# Altium schematic sheet Power.SchDoc
size A4; DocumentNumber: 2; SheetNumber: 2; SheetTotal: 4
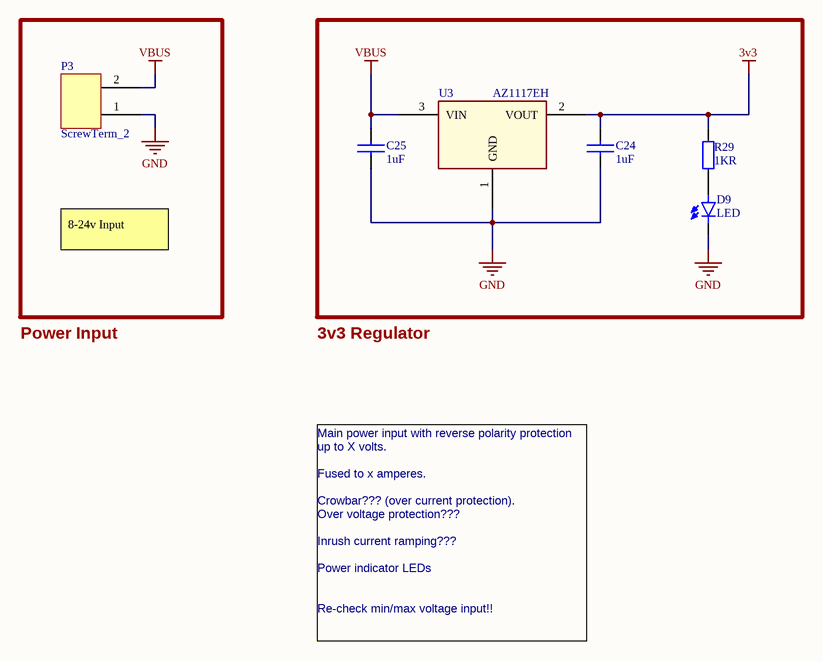
[diagram p0: Power.SchDoc]

## Parts
C24  1uF  [RESC0603(1608)_N]
C25  1uF  [RESC0603(1608)_N]
D9  LED  [0603]
P3  ScrewTerm_2  [ScrewTerm_2]
R29  1KR  [RESC0603(1608)_N]
U3  AZ1117EH  [SOT-223]

## Nets
3v3: C24.1 R29.1 U3.2(VOUT)
GND: C24.2 C25.2 D9.1 P3.1 U3.1(GND)
VBUS: C25.1 P3.2 U3.3(VIN)
NetD9_2: D9.2 R29.2

## Notes on the sheet
- 8-24v Input
- Power Input
- 3v3 Regulator
- Main power input with reverse polarity protection up to X volts.
  Fused to x amperes.
  Crowbar??? (over current protection).
  Over voltage protection???
  Inrush current ramping???
  Power indicator LEDs
  Re-check min/max voltage input!!

## Library data of the parts
C24 C25 = Capacitor: Non polarized capacitor; Manufacturer: *; Mounting Technology: Surface Mount; PartNumber: *; Digikey Part Number: *
R29 = Resistor: ComponentLink1Description: Land patterns; ComponentLink1URL: https://www.vishay.com/docs/60119/landpatterns.pdf; PartNumber: *; Manufacturer: *; Mounting Technology: Surface Mount; Digikey Part Number: *; ComponentLink2Description: 1k digikey; ComponentLink2URL: https://www.digikey.com.au/product-detail/en/yageo/RC0603JR-071KL/311-1.0KGRCT-ND/729624; ComponentLink3Description: shunt digikey; ComponentLink3URL: https://www.digikey.com.au/product-detail/en/yageo/PF1206FRF070R02L/311-0.02AJCT-ND/2178365
U3 = AZ1117EH: Manufacturer: Diodes Incorporated; PartNumber: AZ1117EH-3.3TRG1; ComponentLink1Description: Datasheet; ComponentLink1URL: https://www.diodes.com/assets/Datasheets/AZ1117E.pdf; Mounting Technology: Surface Mount; Digikey Part Number: AZ1117EH-3.3TRG1DICT-ND
D9 = LED: PartNumber: *; Manufacturer: *; Mounting Technology: Surface Mount; Digikey Part Number: *
P3 = ScrewTerm_2: ClassName: pour_over